# EAGLE design Spi Flash Smd Programer (EAGLE 6.1)
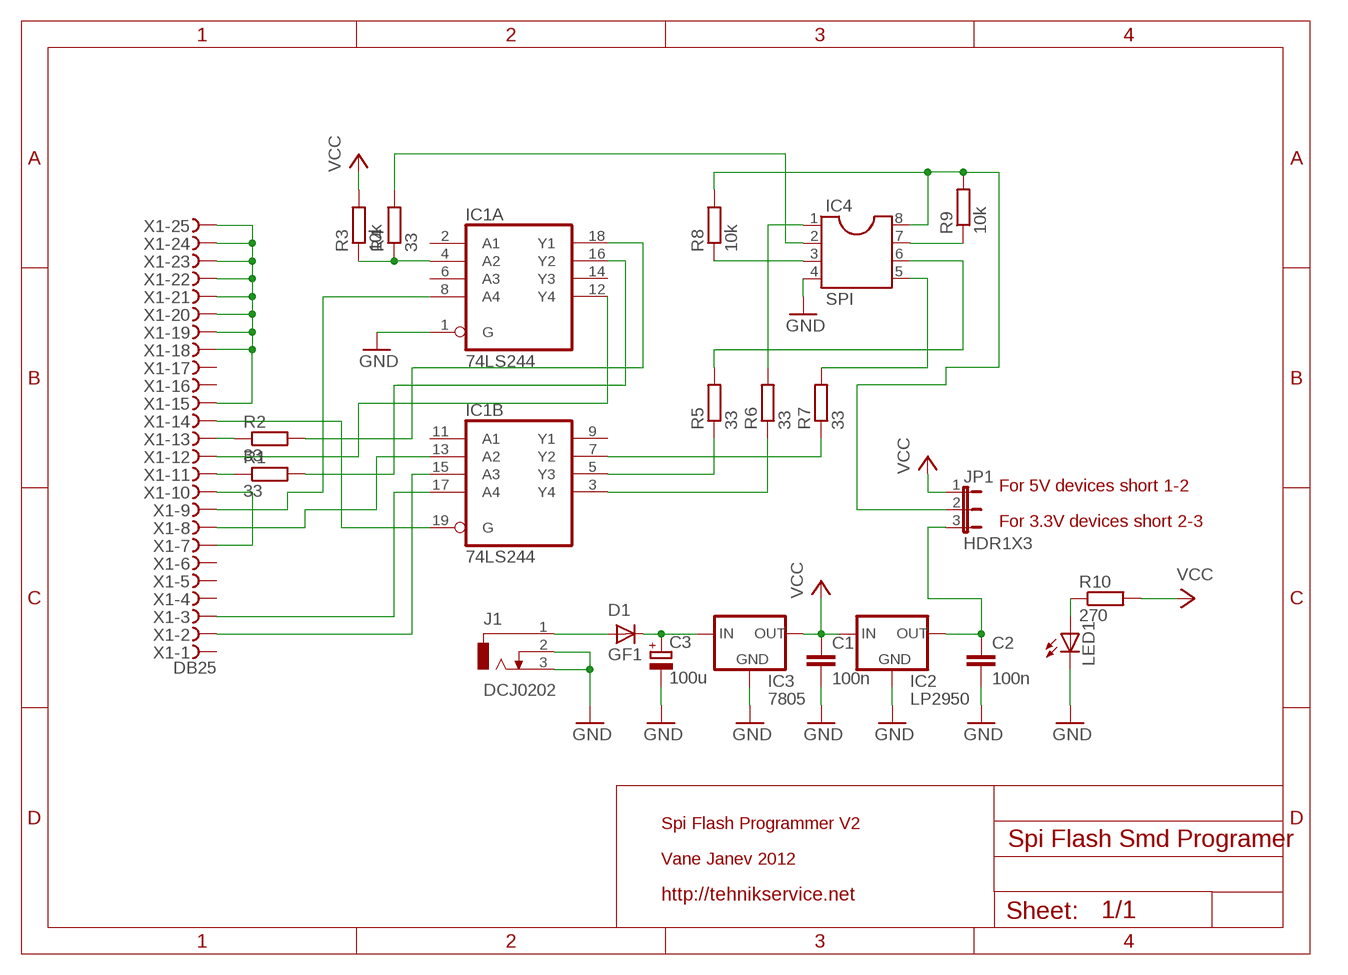
[diagram p0: schematic, sheet 1]

## Parts
C1  100n  C-EUC0402  [C0402]
C2  100n  C-EUC0402  [C0402]
C3  100u  CPOL-EU150CLZ-0810  [150CLZ-0810]
D1  GF1  [SMA-DO214AC]
IC1  74LS244  74LS244DW  [SO20W]
IC2  LP2950  LP2950CDT-3.3  [DPACK]
IC3  7805  LP2950CDT-5.0  [DPACK]
IC4  SPI  DIL8S  [SOCKET-08]
J1  DCJ0202  [DCJ0202]
JP1  HDR1X3  JP2E  [JP2]
LED1  LAP4-TOP  [P47F-TOP]
R1  33  R-EU_R1005  [R1005]
R2  33  R-EU_R1005  [R1005]
R3  10k  R-EU_R1005  [R1005]
R4  33  R-EU_R1005  [R1005]
R5  33  R-EU_R1005  [R1005]
R6  33  R-EU_R1005  [R1005]
R7  33  R-EU_R1005  [R1005]
R8  10k  R-EU_R1005  [R1005]
R9  10k  R-EU_R1005  [R1005]
R10  270  R-EU_R1005  [R1005]
X1  DB25  F25HPS  [F25HP]

## Nets
GND: C1.2 C2.2 C3.- IC1.1(A:G) IC2.4(GND) IC3.4(GND) IC4.4 J1.2 J1.3 LED1.C
N$1: C2.1 IC2.3(OUT) JP1.3
N$3: C3.+ D1.K(C) IC3.1(IN)
N$4: R1.1 X1.11
N$5: IC1.4(A:A2) R3.1 R4.1
N$6: IC1.5(B:Y3) R5.1
N$7: IC1.3(B:Y4) R6.1
N$8: IC1.7(B:Y2) R7.1
N$9: IC4.3 R8.1
N$10: IC4.7 R9.1
N$11: IC4.8 JP1.2 R8.2 R9.2
N$12: IC4.2 R4.2
N$13: IC4.1 R6.2
N$14: IC4.5 R7.2
N$15: IC4.6 R5.2
N$16: R2.1 X1.13
N$17: IC1.15(B:A3) X1.2
N$18: IC1.17(B:A4) X1.3
N$19: X1.7 X1.10
N$20: IC1.12(A:Y4) X1.12
N$21: IC1.19(B:G) X1.14
N$22: X1.15 X1.18 X1.19 X1.20 X1.21 X1.22 X1.23 X1.24 X1.25
N$23: IC1.13(B:A2) X1.8
N$24: IC1.8(A:A4) X1.9
N$25: IC1.16(A:Y2) R1.2
N$26: IC1.18(A:Y1) R2.2
N$27: D1.A J1.1
N$28: LED1.A R10.1
VCC: C1.1 IC2.1(IN) IC3.3(OUT) JP1.1 R3.2 R10.2
Unconnected: IC1.2(A:A1) IC1.6(A:A3) IC1.9(B:Y1) IC1.11(B:A1) IC1.14(A:Y3) X1.1 X1.4 X1.5 X1.6 X1.16 X1.17

## Notes on the sheet
- For 5V devices short 1-2
- For 3.3V devices short 2-3
- Spi Flash Programmer V2
- Vane Janev 2012
- http://tehnikservice.net

## Power pins joined to a net without a drawn wire
GND: IC1.10(P:GND)
VCC: IC1.20(P:VCC)

## Library data of the parts
C1 C2 = resistor:C-EU: CAPACITOR, European symbol
C3 = resistor:CPOL-EU: POLARIZED CAPACITOR, European symbol
D1 = diode:GF1: DIODE
IC1 = 74xx-eu:74*244: Octal BUFFER and LINE DRIVER, 3-state
IC2 IC3 = v-reg:LP2950?*: Source: http://cache.national.com/ds/LP/LP2950.pdf
IC4 = ic-package:DIL8: Dual In Line / Socket
J1 = con-jack:DCJ0202: DC POWER JACK Source: DCJ0202.pdf; OC_FARNELL: unknown; OC_NEWARK: unknown
JP1 = jumper:JP2E: JUMPER
LED1 = led:*P4: PointLED® Enhanced Thinfilm LED TOP & BOTTOM mount LS P47F, LR P47F, LA P47F, LY P47F, LT P4SG, LB P4SG, LW P4SG Source: http://catalog.osram-os.com .. LA_LR_LS_LY_P47F_Pb_free.pdf
R1-R9 = resistor:R-EU_: RESISTOR, European symbol
R10 = rcl:R-EU_: RESISTOR, European symbol
X1 = con-subd:F25?S: SUB-D; OC_FARNELL: unknown; OC_NEWARK: unknown

## Board
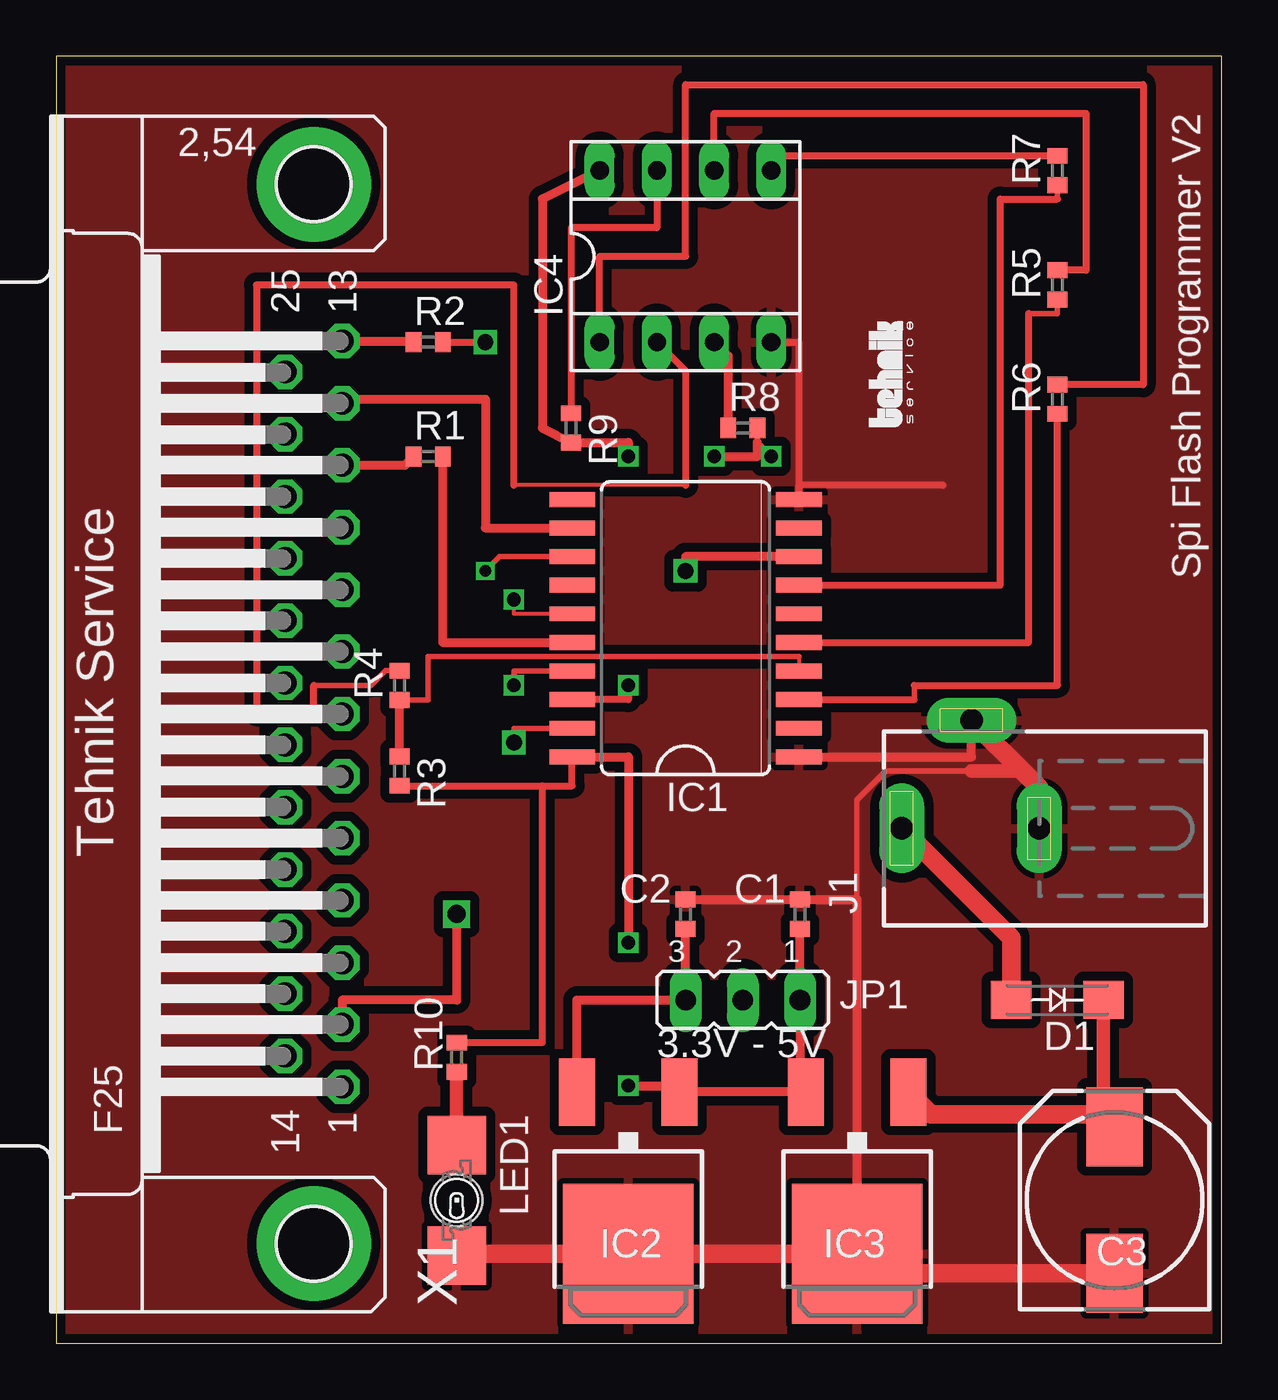
[diagram p1: board, top side]
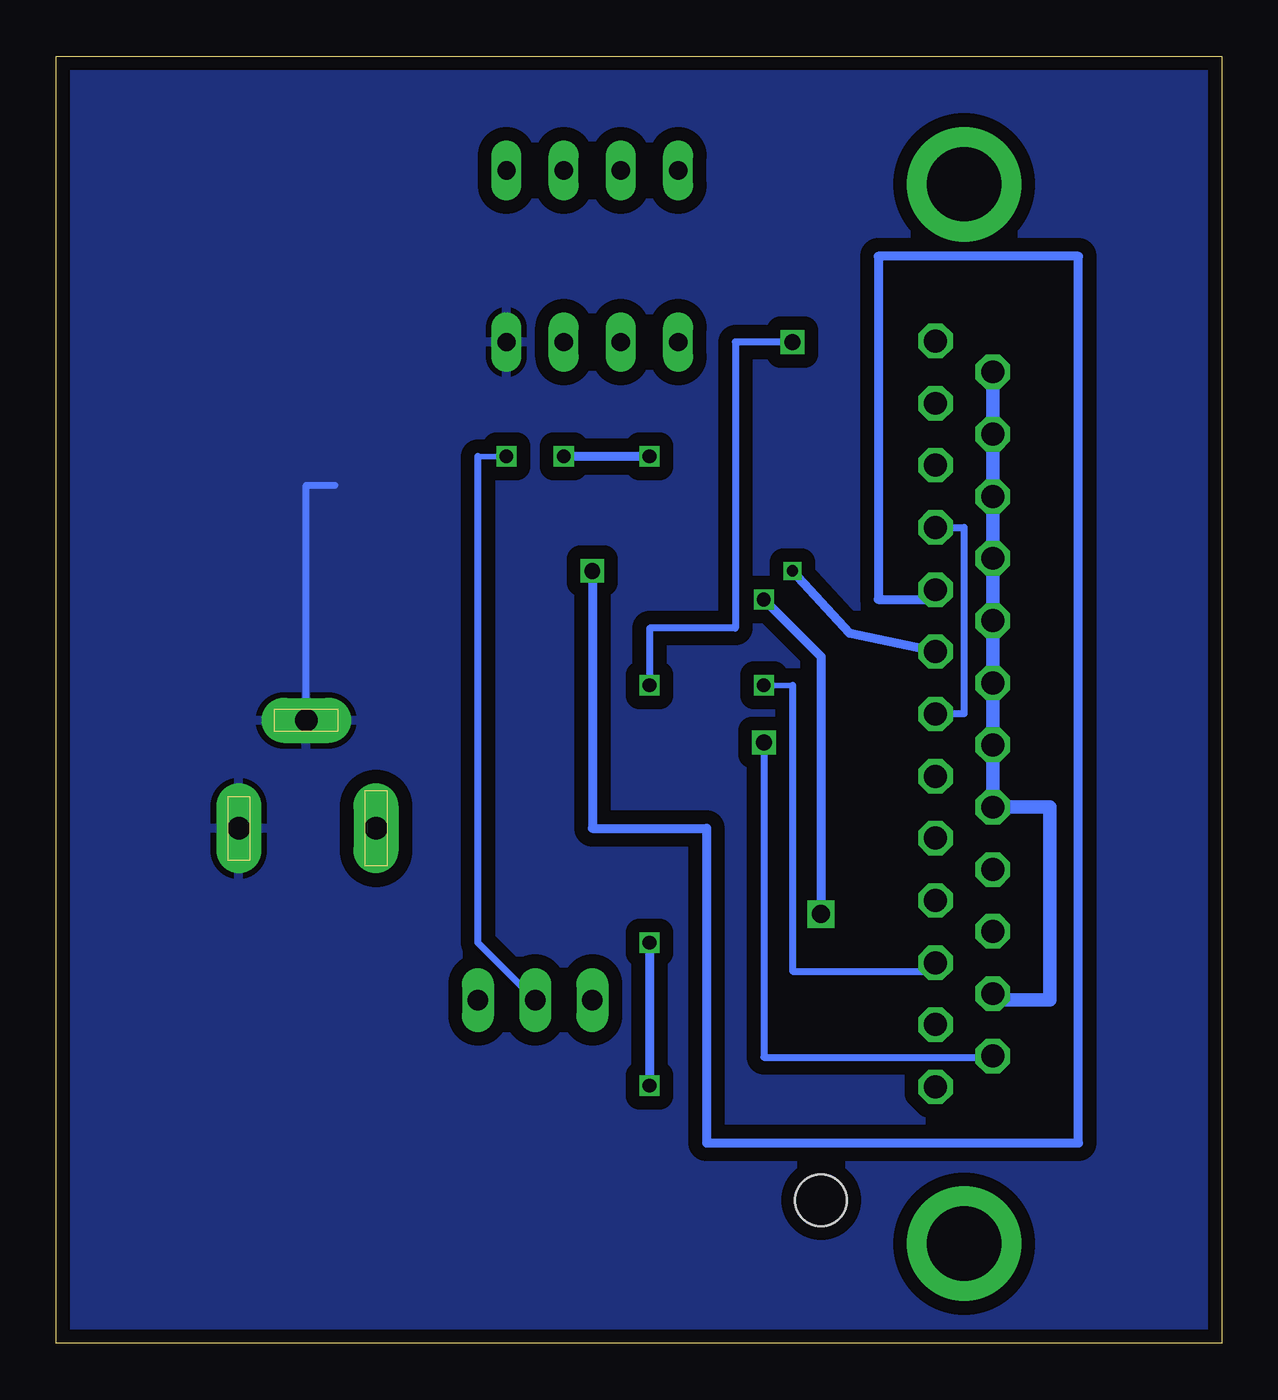
[diagram p2: board, bottom side, seen from below]

Size 51.74 x 57.14 mm. Coordinates in mm from the lower left corner, seen from the top.
Outline: 0,0 51.74,0 51.74,57.14 0,57.14 0,0
Copper layers (1*16): Top 0.035mm / dielectric 1.5mm / Bottom 0.035mm
Design rules "default": minimum track width 6mil, minimum drill 12mil, track to track 6mil, track to pad 6mil, pad to pad 6mil, via to via 6mil, smd to smd 0mil, copper to edge 10mil, drill to drill 10mil, minimum pad ring 10mil, minimum via ring 6mil, stop-mask expansion 2mil, vias tented up to drill 100mil, thermal gap 10mil

### Footprints (pad centres in the part's own frame; a part is rotated, then mirrored left to right if it is on the bottom)
C0402 = smd 0.7 x 0.9: 1 -0.65,0; 2 0.65,0
150CLZ-0810 = smd 3.5 x 2.5: + 3.25,0; - -3.25,0
SMA-DO214AC = smd 1.8 x 1.7: A -2.05,0; K 2.05,0
SO20W = smd 0.66 x 2.032: 1 -5.715,-5.029; 2 -4.445,-5.029; 3 -3.175,-5.029; 4 -1.905,-5.029; 5 -0.635,-5.029; 6 0.635,-5.029; 7 1.905,-5.029; 8 3.175,-5.029; 9 4.445,-5.029; 10 5.715,-5.029; 11 5.715,5.029; 12 4.445,5.029; 13 3.175,5.029; 14 1.905,5.029; 15 0.635,5.029; 16 -0.635,5.029; 17 -1.905,5.029; 18 -3.175,5.029; 19 -4.445,5.029; 20 -5.715,5.029
DPACK = smd 1.6 x 3: 1 -2.28,-4.8; 3 2.28,-4.8 | smd 5.8 x 6.2: 4 0,2.38
SOCKET-08 = drill 0.813 long: 1 -3.81,-3.81; 2 -1.27,-3.81; 3 1.27,-3.81; 4 3.81,-3.81; 5 3.81,3.81; 6 1.27,3.81; 7 -1.27,3.81; 8 -3.81,3.81
DCJ0202 = drill 1 pad 2 long: 1 0,3.1; 2 4.8,0; 3 0,-3
JP2 = drill 0.914 long: 1 -2.54,0; 2 0,0; 3 2.54,0
P47F-TOP = smd 2.6 x 2.6: A -2.45,0; C 2.45,0 | hole 2.3: 0,0
R1005 = smd 0.7 x 0.9: 1 -0.65,0; 2 0.65,0
F25HP = drill 1.016 octagon: 1 -16.561,-1.27; 2 -13.792,-1.27; 3 -11.049,-1.27; 4 -8.28,-1.27; 5 -5.512,-1.27; 6 -2.769,-1.27; 7 0,-1.27; 8 2.769,-1.27; 9 5.512,-1.27; 10 8.28,-1.27; 11 11.049,-1.27; 12 13.792,-1.27; 13 16.561,-1.27; 14 -15.189,1.27; 15 -12.421,1.27; 16 -9.652,1.27; 17 -6.909,1.27; 18 -4.14,1.27; 19 -1.372,1.27; 20 1.372,1.27; 21 4.14,1.27; 22 6.909,1.27; 23 9.652,1.27; 24 12.421,1.27; 25 15.189,1.27 | drill 3.302 pad 5.08: G1 -23.52,0; G2 23.52,0

### Placement (x,y rotation side)
C1  [C0402]  33.02,19.05 90 top
C2  [C0402]  27.94,19.05 90 top
C3  [150CLZ-0810]  46.99,6.35 90 top
D1  44.45,15.24 0 top
E$1  [LOGOT]  38.1,40.64 90 top
IC1  27.94,31.75 90 top
IC2  LM1117  [DPACK]  25.4,6.35 180 top
IC3  35.56,6.35 180 top
IC4  SPI  [SOCKET-08]  27.94,48.26 0 top
J1  40.64,22.86 90 top
JP1  [JP2]  30.48,15.24 180 top
LED1  17.78,6.35 270 top
R1  [R1005]  16.51,39.37 0 top
R2  [R1005]  16.51,44.45 0 top
R3  [R1005]  15.24,25.4 270 top
R4  [R1005]  15.24,29.21 90 top
R5  [R1005]  44.45,46.99 90 top
R6  [R1005]  44.45,41.91 90 top
R7  [R1005]  44.45,52.07 90 top
R8  [R1005]  30.48,40.64 0 top
R9  [R1005]  22.86,40.64 270 top
R10  [R1005]  17.78,12.7 90 top
X1  [F25HP]  11.43,27.94 90 top

### Tracks (layer width: path | path; a pad name or v marks a point on that pad's centre or on a via)
GND
  Top 0.254: 35.56,19.7 35.56,24.13 36.83,25.4 40.64,25.4
  Top 0.305: IC4.4 32.97,44.45 IC1.10 32.97,38.1 39.37,38.1
  Top 0.406: IC3.4 35.56,19.7 C1.2 C2.2 | IC1.1 40.64,26.03 40.64,27.94
  Top 0.61: IC3.4 35.56,3.1 | 40.64,25.4 42.9,25.4 43.04,25.26
  Top 0.813: C3.- 35.56,3.1 35.56,3.81 | IC2.4 25.4,3.81 | IC2.4 17.78,3.97 LED1.C | IC3.4 IC2.4 | J1.2 43.04,25.26 43.64,24.66 J1.3
  Bottom 0.305: J1.2 40.64,38.1 39.37,38.1
  pour Top (isolate 0.406): 0,57.15 52.07,57.15 52.07,0 0,0
  pour Bottom (isolate 0.61): 0,57.15 52.07,57.15 52.07,0 0,0
N$1
  Top 0.406: IC2.3 23.12,15.24 JP1.3 C2.1
N$3
  Top 0.61: C3.+ 46.5,9.6 D1.K
  Top 0.813: IC3.1 38.83,10.16 46.99,10.16 C3.+
N$4
  Top 0.406: X1.11 15.48,38.99 R1.1
N$5
  Top 0.178: 32.97,30.48 IC1.4
  Top 0.254: R4.1 16.51,28.56 16.51,30.48 32.97,30.48
  Top 0.406: R3.1 R4.1
N$6
  Top 0.254: 43.18,45.72 44.45,45.72 R5.1
  Top 0.305: IC1.5 43.18,31.12 43.18,45.72
N$7
  Top 0.254: 38.1,28.58 38.1,29.21
  Top 0.305: IC1.3 38.1,28.58 | 38.1,29.21 44.45,29.21 R6.1
N$8
  Top 0.254: 44.45,50.8 R7.1
  Top 0.305: IC1.7 41.91,33.66 41.91,50.8 44.45,50.8
N$9
  Top 0.406: IC4.3 29.83,43.83 R8.1
N$10
  Top 0.305: IC4.7 26.67,49.53 22.86,49.53 R9.1
N$11  (via drill 0.6)
  Top 0.254: v31.75,39.37 31.13,39.99 R8.2
  Top 0.406: IC4.8 21.59,50.8 21.59,40.64 R9.2 25.4,39.99 v25.4,39.37 | v29.21,39.37 31.13,39.37 31.13,39.99
  Bottom 0.254: 33.02,39.37 v31.75,39.37
  Bottom 0.305: JP1.2 33.02,17.78 33.02,39.37
  Bottom 0.406: v25.4,39.37 v29.21,39.37
N$12
  Top 0.178: 27.94,38.1 20.32,38.1
  Top 0.254: 11.43,29.21 13.97,29.21 14.62,29.86 R4.2
  Top 0.305: IC4.2 27.94,43.18 27.94,38.1 | 20.32,38.1 20.32,46.99 8.89,46.99 8.89,27.94 11.43,27.94 11.43,29.21
N$13
  Top 0.305: IC4.1 24.13,48.26 27.94,48.26 27.94,55.88 48.26,55.88 48.26,42.56 R6.2
N$14
  Top 0.305: IC4.5 31.75,52.72 R7.2
N$15
  Top 0.305: IC4.6 29.21,54.61 45.72,54.61 45.72,47.64 R5.2
N$16
  Top 0.406: X1.13 15.81,44.5 R2.1
N$17  (via drill 0.6, 0.8)
  Top 0.178: IC1.15 20.32,32.38 v20.32,33.02
  Top 0.406: v17.78,19.05 17.78,15.24 12.7,15.24 X1.2
  Bottom 0.406: v20.32,33.02 17.78,30.48 v17.78,19.05
N$18  (via drill 0.6)
  Top 0.254: IC1.17 20.32,29.84 v20.32,29.21
  Bottom 0.254: v20.32,29.21 19.05,29.21 | 12.7,16.51 X1.3
  Bottom 0.305: 19.05,29.21 19.05,16.51 12.7,16.51
N$19
  Bottom 0.305: X1.10 11.43,36.22 11.43,27.94 X1.7
N$20
  Top 0.254: X1.12 arc-90 12.88,41.91
  Top 0.406: 12.88,41.91 19.05,41.91 19.05,36.2 IC1.12
N$21  (via drill 0.7)
  Top 0.254: IC1.19 20.32,27.3 v20.32,26.67
  Bottom 0.254: 10.16,12.7 X1.14
  Bottom 0.305: v20.32,26.67 20.32,12.7 10.16,12.7
N$22
  Bottom 0.61: X1.25 X1.24 X1.23 X1.22 X1.21 X1.20 X1.19 X1.18 7.62,23.8 7.62,15.24 10.16,15.24 X1.15
N$23  (via drill 0.5)
  Top 0.254: v19.05,34.29 19.69,34.92 IC1.13
  Bottom 0.406: X1.8 16.51,31.52 v19.05,34.29
N$24  (via drill 0.7)
  Top 0.406: IC1.8 27.94,34.92 v27.94,34.29
  Bottom 0.406: v27.94,34.29 27.94,22.86 22.86,22.86 22.86,8.89 6.35,8.89 6.35,48.26 15.24,48.26 15.24,33.02 12.7,33.02 X1.9
N$25
  Top 0.406: R1.2 17.16,31.12 IC1.16
N$26  (via drill 0.6, 0.7)
  Top 0.305: R2.2 v19.05,44.45 | v25.4,29.21 25.4,28.58 IC1.18
  Bottom 0.305: v19.05,44.45 21.59,44.45 21.59,31.75 25.4,31.75 v25.4,29.21
N$27
  Top 0.813: J1.1 42.4,18 D1.A
N$28
  Top 0.61: LED1.A R10.1
VCC  (via drill 0.6)
  Top 0.305: R3.2 21.59,24.75 | 21.59,24.75 22.91,24.75 IC1.20 | R10.2 21.59,13.35 21.59,24.75
  Top 0.406: C1.1 JP1.1 33.02,11.15 IC3.3 IC2.1 27.68,11.43 v25.4,11.43 | IC1.20 25.4,26.03 v25.4,17.78
  Bottom 0.406: v25.4,17.78 v25.4,11.43

### Text on the board
tNames: Spi Flash Programmer V2 | Tehnik Service | 3.3V - 5V